# Altium schematic sheet esp_stm_v1.SchDoc
size A3
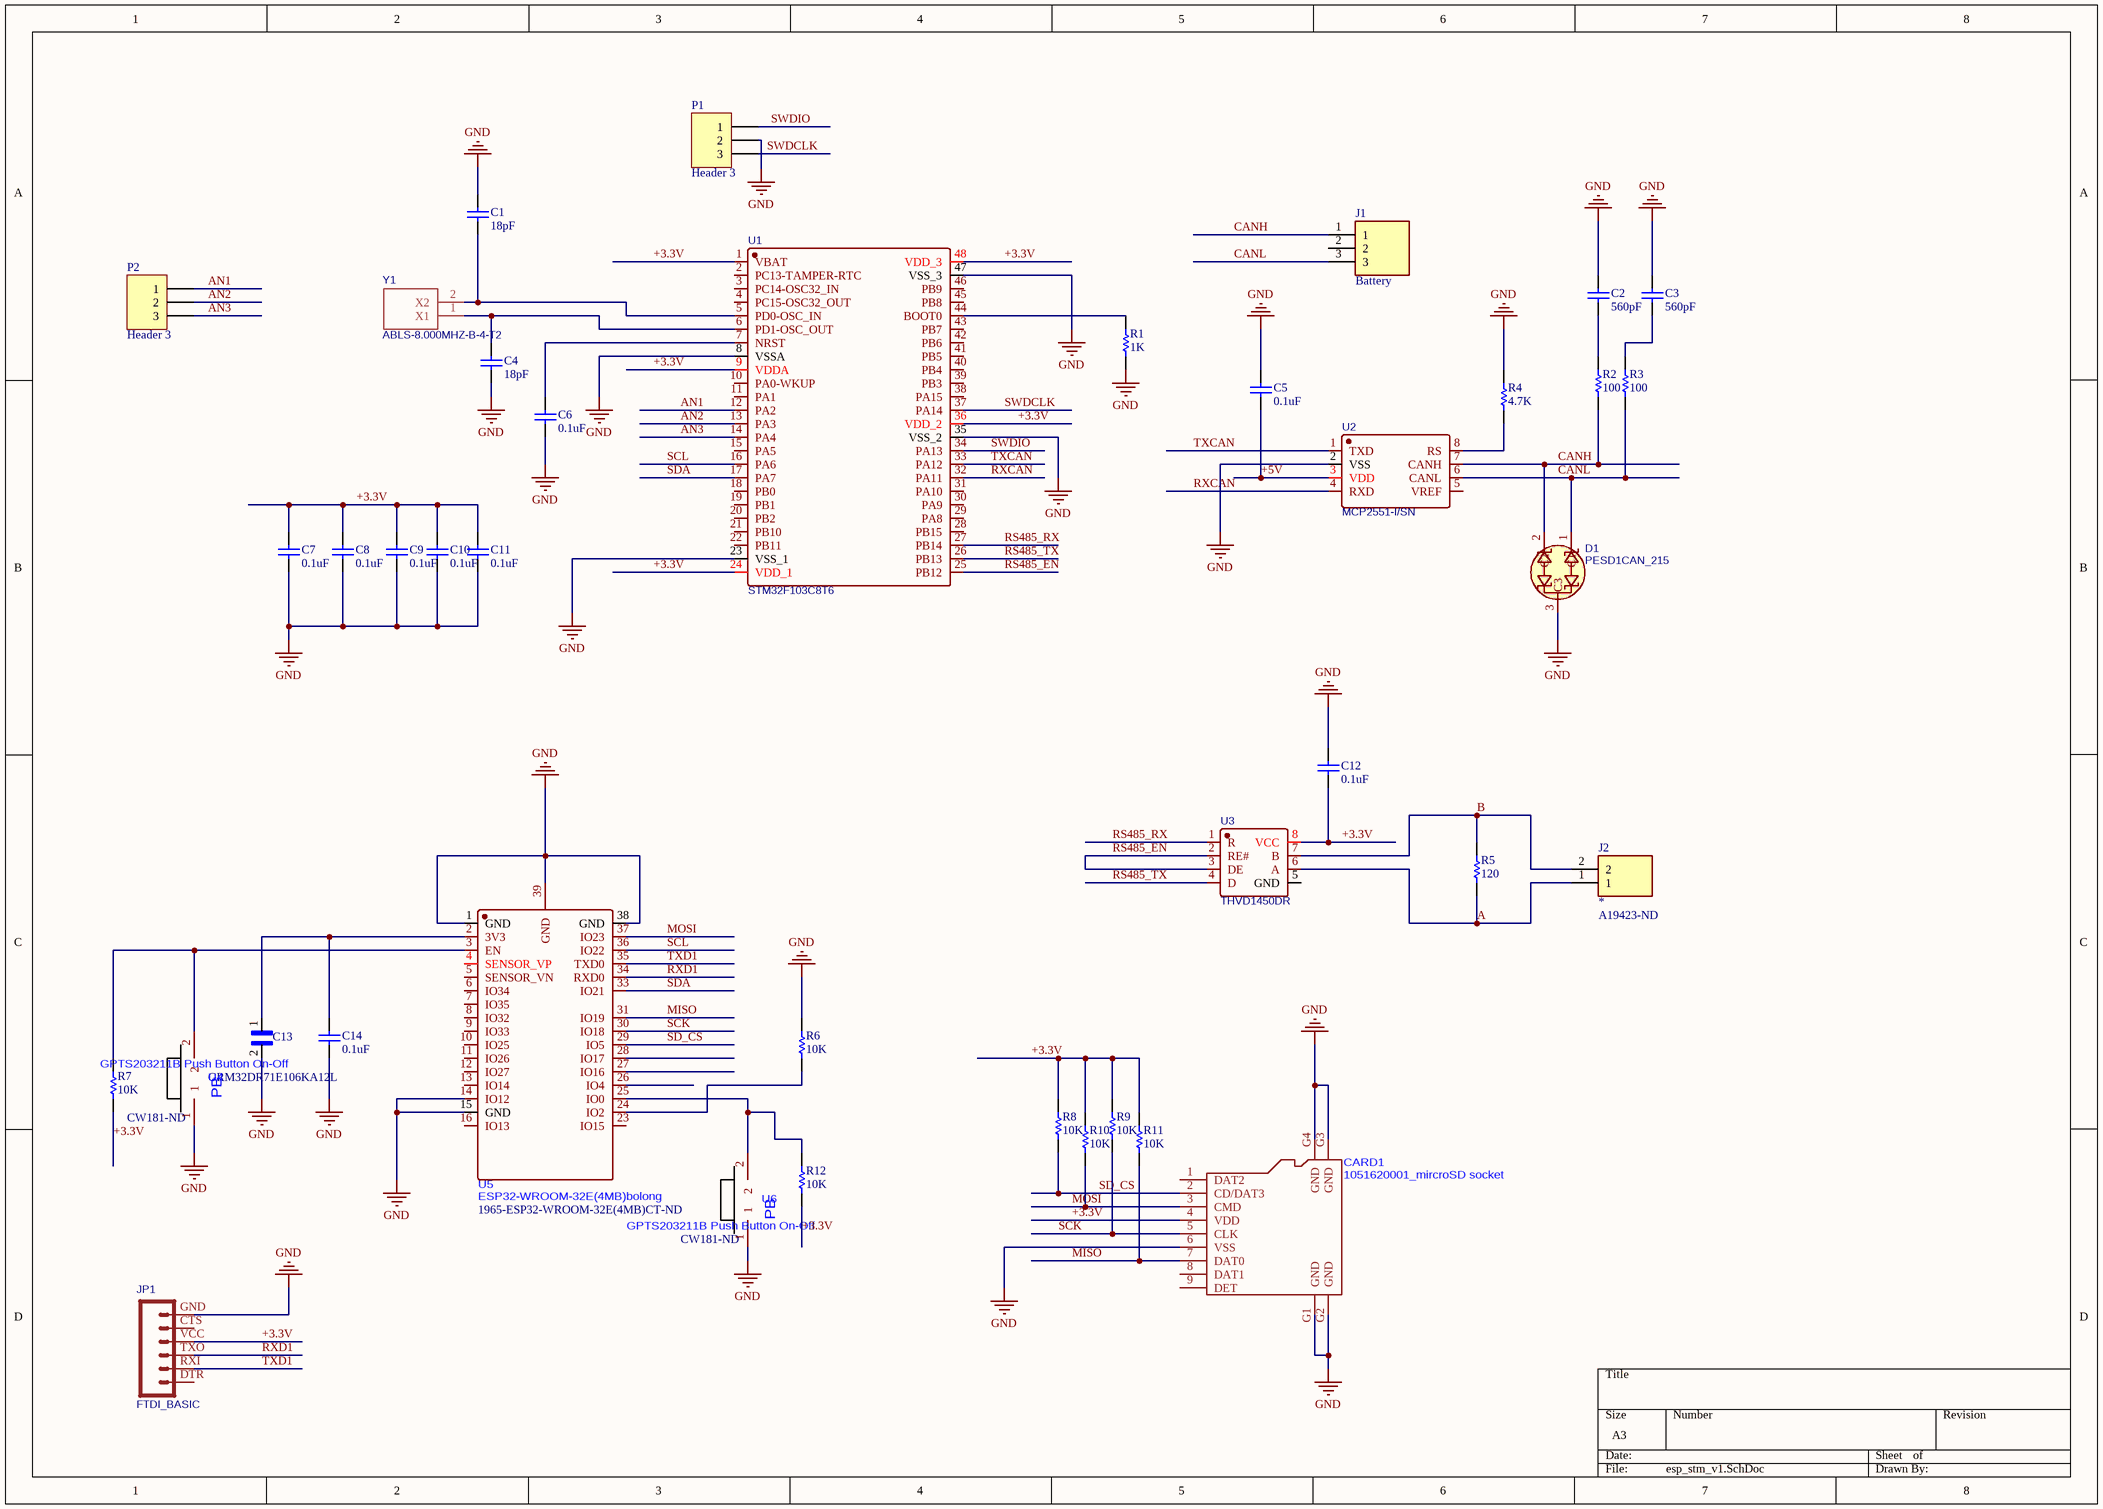
[diagram p0: esp_stm_v1.SchDoc]

## Parts
C1  18pF  [1206]
C2  560pF  [SMD-1206-RES]
C3  560pF  [SMD-1206-RES]
C4  18pF  [1206]
C5  0.1uF  [SMD-1206-RES]
C6  0.1uF  [1206]
C7  0.1uF  [1206]
C8  0.1uF  [1206]
C9  0.1uF  [1206]
C10  0.1uF  [1206]
C11  0.1uF  [1206]
C12  0.1uF  [SMD-1206-RES]
C13  GRM32DR71E106KA12L  [CAPC3225X270N]
C14  0.1uF  [1206]
CARD1  1051620001_mircroSD socket  [1051620001 MOLEX]
D1  PESD1CAN_215  [SOT-23-3]
J1  Comment_1: Battery  [TE_640456-3]  (hidden comment: PR20203VBNN)
J2  Supplier Part Number 1: A19423-ND  [TE_640454-2]  (hidden comment: 640454-2)
JP1  FTDI_BASIC  [FTDI_BASIC]
P1  Header 3  [HDR1X3]
P2  Header 3  [HDR1X3]
R1  1K  [1206]
R2  100  [SMD-1206-RES]
R3  100  [SMD-1206-RES]
R4  4.7K  [SMD-1206-RES]
R5  120  [SMD-1206-RES]
R6  10K  [1206]
R7  10K  [1206]
R8  10K  [1206]
R9  10K  [1206]
R10  10K  [1206]
R11  10K  [1206]
R12  10K  [1206]
U1  STM32F103C8T6  [LQFP-48_L7.0-W7.0-P0.50-LS9.0-BL]
U2  MCP2551-I/SN  [SOIC8-1.27-5X4MM]
U3  THVD1450DR  [SOIC-8_L4.9-W3.9-P1.27-LS6.0-BL]
U4  GPTS203211B Push Button On-Off  Supplier Part Number 1: CW181-ND  [GPTS203211B-PUSHBUTTON-ON-OFF]
U5  ESP32-WROOM-32E(4MB)bolong  Supplier Part Number 1: 1965-ESP32-WROOM-32E(4MB)CT-ND  [WIFI-SMD_ESP32-WROOM-32E]
U6  GPTS203211B Push Button On-Off  Supplier Part Number 1: CW181-ND  [GPTS203211B-PUSHBUTTON-ON-OFF]
Y1  ABLS-8.000MHZ-B-4-T2  [ABLS8000MHZB4T2]

## Nets
GND: C1.1 C2.1 C3.1 C4.2 C5.1 C6.2 C7.2 C8.2 C9.2 C10.2 C11.2 C12.1 C13.2 C14.2 CARD1.6(VSS) CARD1.G1(GND) CARD1.G2(GND) CARD1.G3(GND) CARD1.G4(GND) D1.3(C3) JP1.GND P1.2 R1.2 R4.2 R6.1 U1.8(VSSA) U1.23(VSS_1) U1.35(VSS_2) U1.47(VSS_3) U2.2(VSS) U4.1 U5.1(GND) U5.14(IO12) U5.15(GND) U5.38(GND) U5.39(GND) U6.1
+3.3V: C7.1 C8.1 C9.1 C10.1 C11.1 C12.2 CARD1.4(VDD) JP1.VCC R7.2 R8.1 R9.1 R10.1 R11.1 R12.2 U1.1(VBAT) U1.9(VDDA) U1.24(VDD_1) U1.36(VDD_2) U1.48(VDD_3) U3.8(VCC)
+5V: C5.2 U2.3(VDD)
A: J2.1 R5.2 U3.6(A)
AN1: P2.1 U1.12(PA2)
AN2: P2.2 U1.13(PA3)
AN3: P2.3 U1.14(PA4)
B: J2.2 R5.1 U3.7(B)
CANH: D1.2(C2) J1.1 R2.1 U2.7(CANH)
CANL: D1.1(C1) J1.3 R3.1 U2.6(CANL)
MISO: CARD1.7(DAT0) R11.2 U5.31(IO19)
MOSI: CARD1.3(CMD) R10.2 U5.37(IO23)
RS485_EN: U1.25(PB12) U3.2(RE#) U3.3(DE)
RS485_RX: U1.27(PB14) U3.1(R)
RS485_TX: U1.26(PB13) U3.4(D)
RXCAN: U1.32(PA11) U2.4(RXD)
RXD1: JP1.TXO U5.34(RXD0)
SCK: CARD1.5(CLK) R9.2 U5.30(IO18)
SCL: U1.16(PA6) U5.36(IO22)
SD_CS: CARD1.2(CD/DAT3) R8.2 U5.29(IO5)
SDA: U1.17(PA7) U5.33(IO21)
SWDCLK: P1.3 U1.37(PA14)
SWDIO: P1.1 U1.34(PA13)
TXCAN: U1.33(PA12) U2.1(TXD)
TXD1: JP1.RXI U5.35(TXD0)
NetC1_2: C1.2 U1.5(PD0-OSC_IN) Y1.2(X2)
NetC2_2: C2.2 R2.2
NetC3_2: C3.2 R3.2
NetC4_1: C4.1 U1.6(PD1-OSC_OUT) Y1.1(X1)
NetC6_1: C6.1 U1.7(NRST)
NetC13_1: C13.1 C14.1 U5.2(3V3)
NetR1_1: R1.1 U1.44(BOOT0)
NetR4_1: R4.1 U2.8(RS)
NetR6_2: R6.2 U5.24(IO2)
NetR7_1: R7.1 U4.2 U5.3(EN)
NetR12_1: R12.1 U5.25(IO0) U6.2

Not connected (* = marked no-connect by the designer): CARD1 1(DAT2) 8(DAT1) 9(DET); J1 2; JP1 CTS(5) DTR(1); U1 2(PC13-TAMPER-RTC) 3(PC14-OSC32_IN) 4(PC15-OSC32_OUT) 10(PA0-WKUP) 11(PA1) 15(PA5) 18(PB0) 19(PB1) 20(PB2) 21(PB10) 22(PB11) 28(PB15) 29(PA8) 30(PA9) 31(PA10) 38(PA15) 39(PB3) 40(PB4) 41(PB5) 42(PB6) 43(PB7) 45(PB8) 46(PB9); U2 5(VREF); U3 5(GND); U5 4(SENSOR_VP) 5(SENSOR_VN) 6(IO34) 7(IO35) 8(IO32) 9(IO33) 10(IO25) 11(IO26) 12(IO27) 13(IO14) 16(IO13) 23(IO15) 26(IO4) 27(IO16) 28(IO17)

## Notes on the sheet
- (in symbol GPTS203211B Push Button On-Off) PB

## Library data of the parts
C1-C12 C14 = Cap: Capacitor; Manufacture Name: Wurth Electronics Inc.; Manufacture Part Number: 885012208087; Vendor Part Number: 732-8127-1-ND; Vendor Name: Digikey
C13 = GRM32DR71E106KA12L: SMD Capacitor X7R_EIA_ with Capacitance: 10uF Tol. 10%. Rated Voltage: 25Vdc; MF: Murata Electronics; MP: GRM32DR71E106KA12L; Availability: Unavailable; Package: 1210 Murata; Value: *; SnapEDA_Link: https://www.snapeda.com/parts/GRM32DR71E106KA12L/Murata%20Electronics%20North%20America/view-part/282006/?ref=snap; Price: None
D1 = PESD1CAN_215: Manufacturer: Nexperia USA Inc.; Contributor: carlo1300; spicePre: D; spiceSymbolName: PESD1CAN_215
J1 = 640456-3: Connector Header Through Hole 3 position 0.100 _2.54mm_; MF: METZ CONNECT USA Inc.; MP: PR20203VBNN; Package: None; Value: *; Digi-Key_Purchase_URL: https://www.digikey.com/product-detail/en/te-connectivity-amp-connectors/640456-3/A19470-ND/259010?utm_source=snapeda&utm_medium=aggregator&utm_campaign=symbol; TE_purchase_URL: https://www.te.com/usa-en/product-640456-3.html?te_bu=Cor&te_type=disp&te_campaign=seda_glo_cor-seda-global-disp-prtnr-fy19-seda-model-bom-cta_sma-317_1&elqCampaignId=32493; Digi-Key_Part_Number: 1849-1003-ND; EU_RoHS_Compliance: Compliant; SnapEDA_Link: https://www.snapeda.com/parts/640456-3/TE%20Connectivity%20AMP%20Connectors/view-part/965995/?ref=snap
J2 = 640454-2: 02P MTA100 HDR ASSY SQ STR POL; Centerline_Pitch: 2.54 mm[.1 in]; Number_of_Positions: 2; Product_Type: Connector; MF: TE Connectivity; Package: None; Value: *; MP: 640454-2; Digi-Key_Purchase_URL: https://www.digikey.com/product-detail/en/te-connectivity-amp-connectors/1-640454-2/A19439-ND/258994?utm_source=snapeda&utm_medium=aggregator&utm_campaign=symbol; SnapEDA_Link: https://www.snapeda.com/parts/640454-2/TE%20Connectivity%20AMP%20Connectors/view-part/278868/?ref=snap; TE_purchase_URL: https://www.te.com/usa-en/product-640454-2.html?te_bu=Cor&te_type=disp&te_campaign=seda_glo_cor-seda-global-disp-prtnr-fy19-seda-model-bom-cta_sma-317_1&elqCampaignId=32493; Digi-Key_Part_Number: A19439-ND; EU_RoHS_Compliance: Compliant; Supplier 1: Digi-Key; Comment_1: *
JP1 = FTDI_BASIC: Contributor: SparkFun; BOM_Manufacturer Part: ?; spicePre: J
P1 P2 = Header 3: Header, 3-Pin; LatestRevisionDate: 17-Jul-2002; LatestRevisionNote: Re-released for DXP Platform.; Publisher: Altium Limited
R1-R12 = Res Semi: Semiconductor Resistor; Manufacture Name: Yageo; Manufacture Part Number: RC1206JR-0710KL; Vendor Part Number: 311-10KERCT-ND; Vendor Name: Digikey
U1 = STM32F103C8T6: Manufacturer: ST(意法半导体); timeStamp: 1455028086; Supplier: LCSC; Manufacturer Part: STM32F103C8T6; Supplier Part: C8734; spicePre: U; spiceSymbolName: STM32F103C8T6
U2 = MCP2551-I/SN: BOM_Manufacturer: MICROCHIP; BOM_Supplier: LCSC; BOM_Manufacturer Part: MCP2551-I/SN; image: //image.lceda.cn/szlcsc/C7376.jpg; spicePre: U; BOM_Supplier Part: C7376
U3 = THVD1450DR: Manufacturer: TI(????); Contributor: LCSC; Supplier: LCSC; Supplier Part: C2671361; Manufacturer Part: THVD1450DR; JLCPCB Part Class: Extended Part; link: https://lcsc.com/eda_search?q=C2671361&%26type=1&ref=editor; spicePre: U; spiceSymbolName: THVD1450DR
Y1 = ABLS-8.000MHZ-B-4-T2: Contributor: Metin Akin; spicePre: Y; spiceSymbolName: ABLS-8.000MHZ-B-4-T2
U4 U6 = GPTS203211B Push Button On-Off: Supplier 1: Digi-Key
U5 = ESP32-WROOM-32E(4MB)bolong: Supplier 1: Digi-Key